# Altium schematic sheet DATN2022.Power.SchDoc
size A
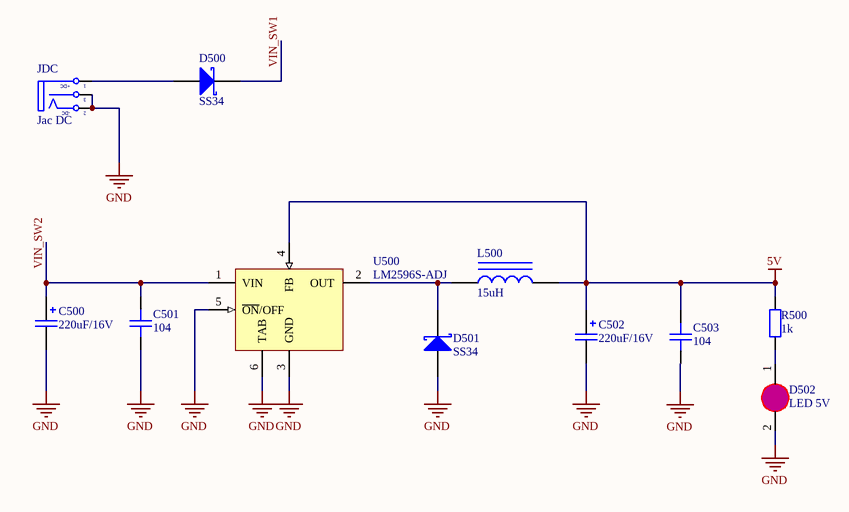
[diagram p0: DATN2022.Power.SchDoc]

## Parts
C500  220uF/16V  [CAP_ALUM_SMD_6377_TYPE_D8]
C501  104  [CAP_CERAMIC_0805(2012mm)]
C502  220uF/16V  [CAP_ALUM_SMD_6377_TYPE_D8]
C503  104  [CAP_CERAMIC_0805(2012mm)]
D500  SS34  [DO214AC_SMA_1808]
D501  SS34  [DO214AC_SMA_1808]
D502  LED 5V  [LED_0805_RED]
JDC  Jac DC  [DC0]
L500  15uH  [INDUCTOR_SMD_12.5x12.5MM]
R500  1k  [RES_0805(2012)]
U500  LM2596S-ADJ  [TO-263-5]

## Nets
5V: C502.1 C503.2 L500.2 R500.2 U500.4(FB)
GND: C500.2 C501.1 C502.2 C503.1 D501.1(A) D502.2(K) JDC.2(TN) JDC.3(S) U500.3(GND) U500.5(~{ON}/OFF) U500.6(TAB)
VIN_SW1: D500.2(K)
VIN_SW2: C500.1 C501.2 U500.1(VIN)
NetD500_1: D500.1(A) JDC.1(T)
NetD501_2: D501.2(K) L500.1 U500.2(OUT)
NetD502_1: D502.1(A) R500.1

## Notes on the sheet
- (in symbol DCIN) +DC; -DC

## Library data of the parts
C500 C502 = UWT1C221MCL1GS: CAP ALUM 220UF 16V 20% SMD; Manufacturer: Nichicon; Capacitance: 220µF; Lifetime @ Temp.: 1000 Hrs @ 105°C; Ripple Current: 105mA; Surface Mount Land Size: 0.260" L x 0.260" W (6.60mm x 6.60mm); Supplier 1: Digi-Key; Manufacturer Part Number: UWT1C221MCL1GS; RoHS: RoHS Compliant; Category: Capacitors; Stock 1: 45106; Pricing 1: 1=0.46, 10=0.366, 100=0.2205, 250=0.16536 (USD); Voltage Rating: 16V; Tolerance: ±20%; Operating Temperature: -55°C ~ 105°C; Features: General Purpose; ESR (Equivalent Series Resistance): -; Impedance: -; Mounting Type: Surface Mount; Package / Case: Radial, Can - SMD; Size / Dimension: 0.248" Dia (6.30mm); Height - Seated (Max): 0.303" (7.70mm); Lead Spacing: -; Packaging: Cut Tape (CT); ComponentLink1URL: http://www.nichicon.co.jp/english/products/pdfs/e-wt.pdf; ComponentLink1Description: http://www.nichicon.co.jp/english/products/pdfs/e-wt.pdf; Supplier Part Number 1: 493-2179-1-ND
C501 C503 = Cap Cer 0805 (2012): Capacitor Ceramic SMD 0805(2012); Value: 33p; Type: Tụ Ceramic; Published: 8-Jun-2000; LatestRevisionDate: 17-Jul-2002; LatestRevisionNote: Re-released for DXP Platform.; PackageReference: RAD-0.3; Publisher: Altium Limited; Component Type: Tụ Ceramic
D500 D501 = Diode B340A: Schottky Diode; Published: 8-Jun-2000; LatestRevisionDate: 17-Jul-2002; LatestRevisionNote: Re-released for DXP Platform.; PackageReference: SMB; Publisher: Altium Limited; Code_JEDEC: DO-214-AA
D502 = LED0805: LED SMD 0805
JDC = DCIN: Jac DC input; Value: Jac DC
L500 = SRR1260-150MCT-ND: INDUCTOR POWER 15UH 5.0A SMD; Manufacturer: Bourns Inc.; Type: Ferrite Core; Inductance: 15µH; Current Rating: 5A; Current - Saturation: 4.6A; Tolerance: ±20%; Material - Core: Ferrite; Shielding: Shielded; DC Resistance (DCR): 27 mOhm Max; Q @ Freq: 25 @ 2.52MHz; Frequency - Self Resonant: 17.6MHz; Frequency - Test: 100kHz; Supplier 1: Digi-Key; Manufacturer Part Number: SRR1260-150M; RoHS: RoHS Compliant; Category: Inductors, Coils, Chokes; Stock 1: 0; Pricing 1: 1=0.93, 10=0.872, 25=0.8136, 50=0.6976, 100=0.6626, 250=0.60452 (USD); Packaging: Cut Tape (CT); Operating Temperature: -40°C ~ 125°C; Package / Case: Non Standard; Size / Dimension: 0.492" L x 0.492" W x 0.236" H (12.50mm x 12.50mm x 6.00mm); Mounting Type: Surface Mount; ComponentLink1URL: http://www.bourns.com/data/global/pdfs/SRR1260.pdf; ComponentLink1Description: http://www.bourns.com/data/global/pdfs/SRR1260.pdf; Supplier Part Number 1: SRR1260-150MCT-ND
R500 = R0805: Resistor SMD 0805; Value: 0805; Published: 8-Jun-2000; LatestRevisionDate: 17-Jul-2002; LatestRevisionNote: Re-released for DXP Platform.; PackageReference: AXIAL-0.4; Publisher: Altium Limited
U500 = LM2596S-ADJ: SIMPLE SWITCHER Power Converter 150 KHz 3A Step-Down Voltage Regulator; Manufacturer: National Semiconductor; PackageTopMarking: NSUZXYTT*LM2596S*-ADJ P+; PowerWise: N; FirstPublished: 4-Dec-2008; DatasheetVersion: May-2002; PackageVersion: revD, Apr-2005; PackageReference: TS5B; Publisher: Altium Limited; PackageDescription: TO-263, Molded, .400 x .390 x .180in, 5 Lead, .067in Pitch, Surface Mount; CompType: Switcher; PartNumber: LM2596S-ADJ; RoHS: O; PinCount: 5; DigiKeyPartNumber: LM2596S-ADJ-ND; Code_JEDEC: MO-169-AB; ComponentLink1Description: LM2596 Datasheet; ComponentLink1URL: http://www.national.com/ds/LM/LM2596.pdf; ComponentLink2Description: LM2596 Web Page; ComponentLink2URL: http://www.national.com/pf/LM/LM2596.html; ComponentLink3Description: TS5B Package Page; ComponentLink3URL: http://www.national.com/packaging/folders/ts5b.html